# EAGLE schematic CYBERPHYS_DEMONSTRATOR_ARCHITECTURE_PHYSICAL_REV_D (EAGLE 9.6.2)
DOC_NAME: CYBERPHYS DEMONSTRATOR ARCHITECTURE - PHYSICAL; DOC_NUMBER: N/A; DOC_REVISION: D; INITIALS_CHECKED: TEAM; INITIALS_DRAWN: KJD

## Sheet 1 of 4
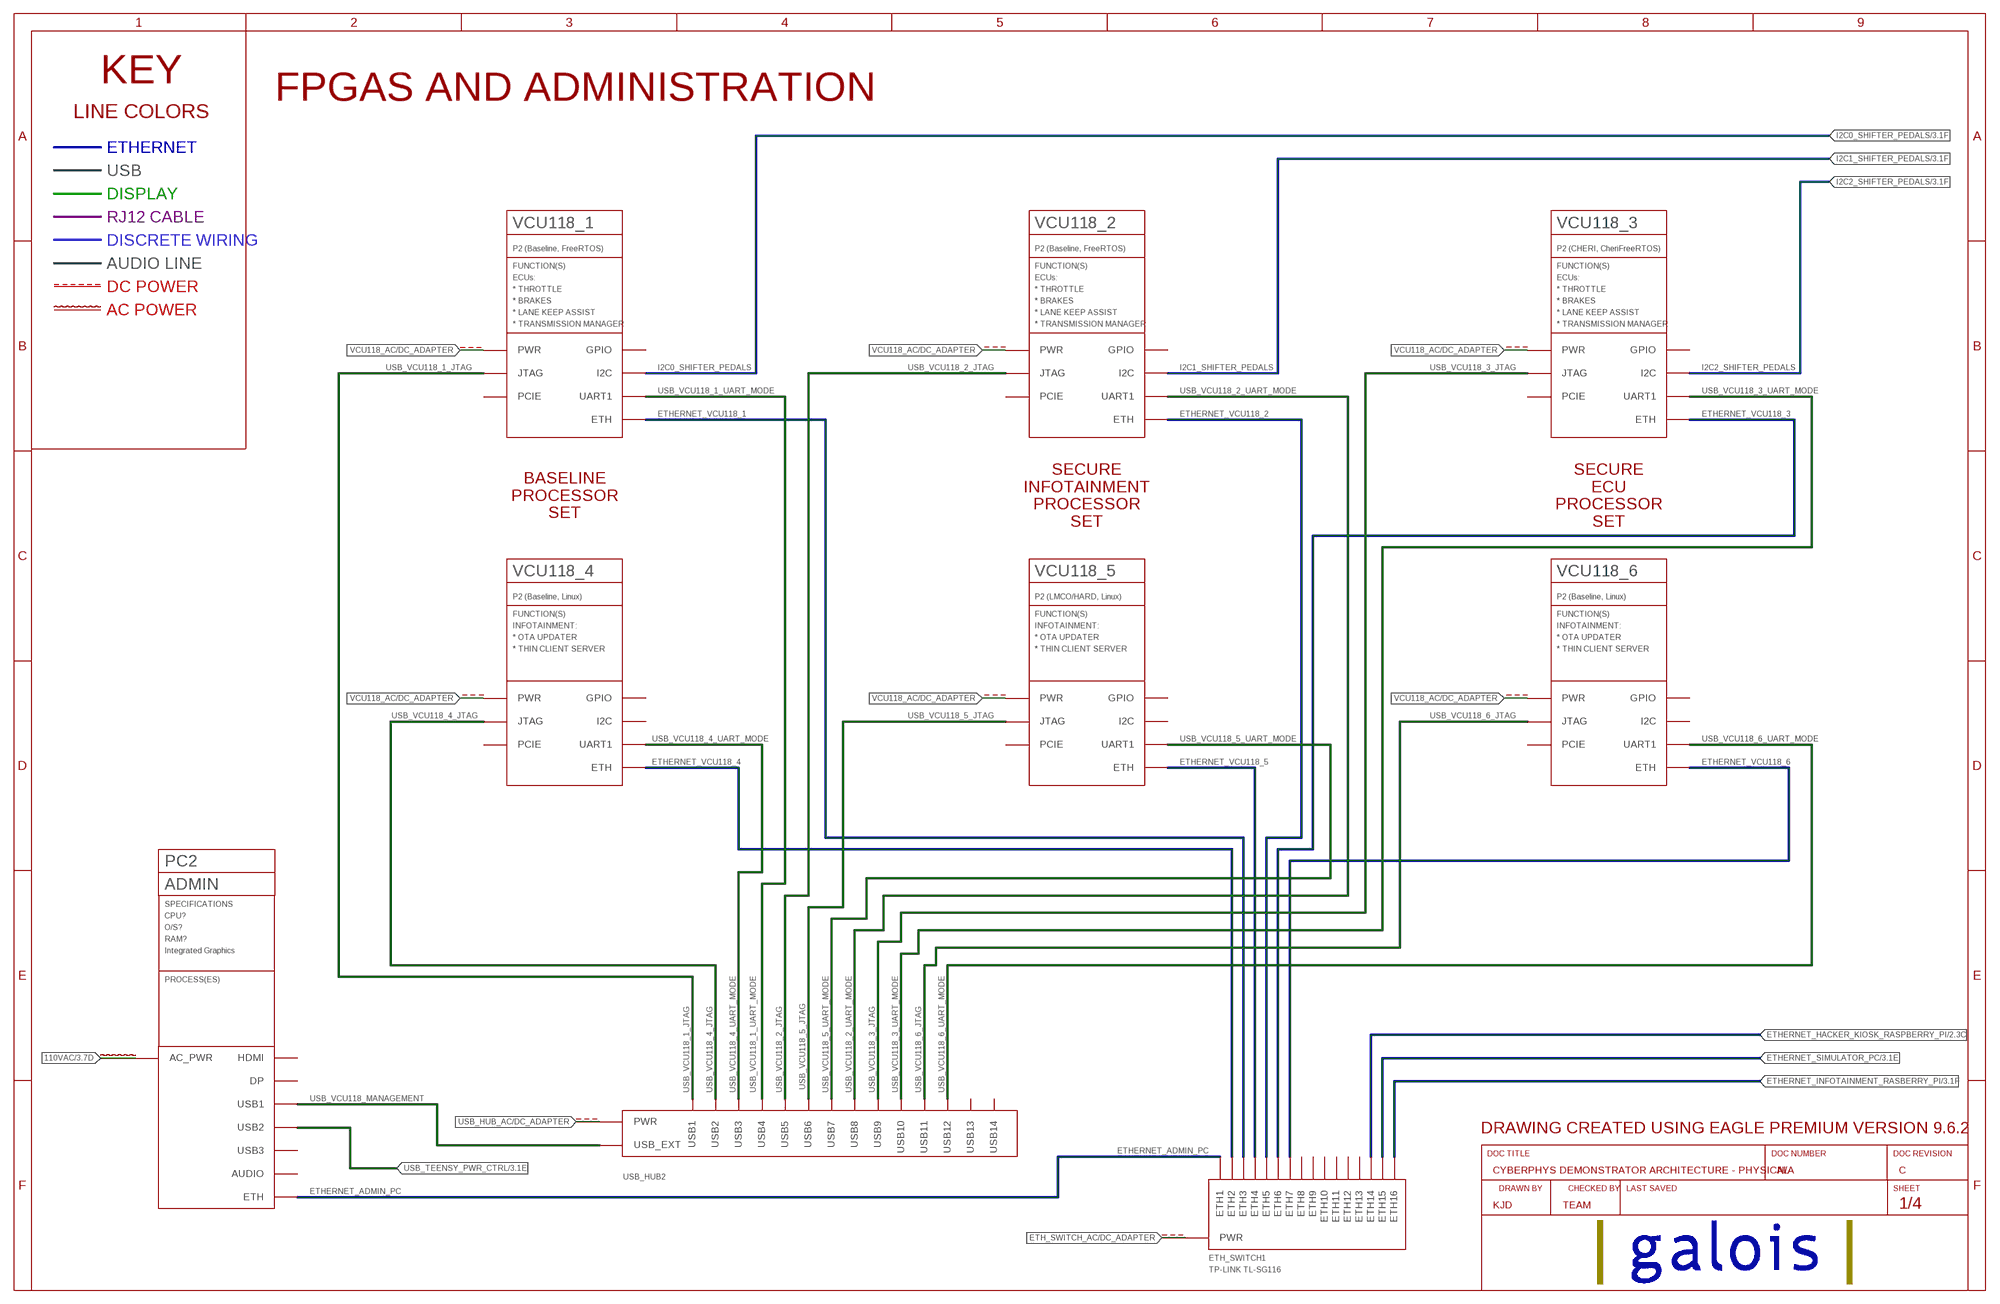
[diagram p0: schematic, sheet 1]

### Parts
ETH_SWITCH1  TP-LINK TL-SG116  SWITCH_16PORT  (no package)
PC2  ADMIN  PC  (no package)
USB_HUB2  USB_HUB_1X14  (no package)
VCU118_1  P2 (Baseline, FreeRTOS)  GFE//VCU118  (no package)
VCU118_2  P2 (Baseline, FreeRTOS)  GFE//VCU118  (no package)
VCU118_3  P2 (CHERI, CheriFreeRTOS)  GFE//VCU118  (no package)
VCU118_4  P2 (Baseline, Linux)  GFE//VCU118  (no package)
VCU118_5  P2 (LMCO/HARD, Linux)  GFE//VCU118  (no package)
VCU118_6  P2 (Baseline, Linux)  GFE//VCU118  (no package)

### Nets
110VAC: PC2.AC_PWR ; also sheet 3
ETH_SWITCH_AC/DC_ADAPTER: ETH_SWITCH1.PWR
ETHERNET_ADMIN_PC: ETH_SWITCH1.ETH1 PC2.ETH
ETHERNET_HACKER_KIOSK_RASPBERRY_PI: ETH_SWITCH1.ETH14 ; also sheet 2
ETHERNET_INFOTAINMENT_RASBERRY_PI: ETH_SWITCH1.ETH16 ; also sheet 3
ETHERNET_SIMULATOR_PC: ETH_SWITCH1.ETH15 ; also sheet 3
ETHERNET_VCU118_1: ETH_SWITCH1.ETH3 VCU118_1.ETH
ETHERNET_VCU118_2: ETH_SWITCH1.ETH5 VCU118_2.ETH
ETHERNET_VCU118_3: ETH_SWITCH1.ETH6 VCU118_3.ETH
ETHERNET_VCU118_4: ETH_SWITCH1.ETH2 VCU118_4.ETH
ETHERNET_VCU118_5: ETH_SWITCH1.ETH4 VCU118_5.ETH
ETHERNET_VCU118_6: ETH_SWITCH1.ETH7 VCU118_6.ETH
I2C0_SHIFTER_PEDALS: VCU118_1.I2C ; also sheet 3
I2C1_SHIFTER_PEDALS: VCU118_2.I2C ; also sheet 3
I2C2_SHIFTER_PEDALS: VCU118_3.I2C ; also sheet 3
USB_HUB_AC/DC_ADAPTER: USB_HUB2.PWR
USB_TEENSY_PWR_CTRL: PC2.USB2 ; also sheet 3
USB_VCU118_1_JTAG: USB_HUB2.USB1 VCU118_1.JTAG
USB_VCU118_1_UART_MODE: USB_HUB2.USB4 VCU118_1.UART1
USB_VCU118_2_JTAG: USB_HUB2.USB5 VCU118_2.JTAG
USB_VCU118_2_UART_MODE: USB_HUB2.USB8 VCU118_2.UART1
USB_VCU118_3_JTAG: USB_HUB2.USB9 VCU118_3.JTAG
USB_VCU118_3_UART_MODE: USB_HUB2.USB10 VCU118_3.UART1
USB_VCU118_4_JTAG: USB_HUB2.USB2 VCU118_4.JTAG
USB_VCU118_4_UART_MODE: USB_HUB2.USB3 VCU118_4.UART1
USB_VCU118_5_JTAG: USB_HUB2.USB6 VCU118_5.JTAG
USB_VCU118_5_UART_MODE: USB_HUB2.USB7 VCU118_5.UART1
USB_VCU118_6_JTAG: USB_HUB2.USB11 VCU118_6.JTAG
USB_VCU118_6_UART_MODE: USB_HUB2.USB12 VCU118_6.UART1
USB_VCU118_MANAGEMENT: PC2.USB1 USB_HUB2.USB_EXT
VCU118_AC/DC_ADAPTER: VCU118_1.PWR VCU118_2.PWR VCU118_3.PWR VCU118_4.PWR VCU118_5.PWR VCU118_6.PWR
Unconnected: ETH_SWITCH1.ETH8 ETH_SWITCH1.ETH9 ETH_SWITCH1.ETH10 ETH_SWITCH1.ETH11 ETH_SWITCH1.ETH12 ETH_SWITCH1.ETH13 PC2.AUDIO PC2.DP PC2.HDMI PC2.USB3 USB_HUB2.USB13 USB_HUB2.USB14 VCU118_1.GPIO VCU118_1.PCIE VCU118_2.GPIO VCU118_2.PCIE VCU118_3.GPIO VCU118_3.PCIE VCU118_4.GPIO VCU118_4.I2C VCU118_4.PCIE VCU118_5.GPIO VCU118_5.I2C VCU118_5.PCIE VCU118_6.GPIO VCU118_6.I2C VCU118_6.PCIE

### Notes on the sheet
- KEY | FPGAS AND ADMINISTRATION
- LINE COLORS
- ETHERNET
- USB
- DISPLAY
- RJ12 CABLE
- DISCRETE WIRING
- AUDIO LINE
- DC POWER
- AC POWER
- BASELINE
  PROCESSOR
  SET
- SECURE
  INFOTAINMENT
  PROCESSOR
  SET
- SECURE
  ECU
  PROCESSOR
  SET
- DRAWING CREATED USING EAGLE PREMIUM VERSION 9.6.2
- CYBERPHYS DEMONSTRATOR ARCHITECTURE - PHYSICAL | N/A | C
- KJD | TEAM

## Sheet 2 of 4
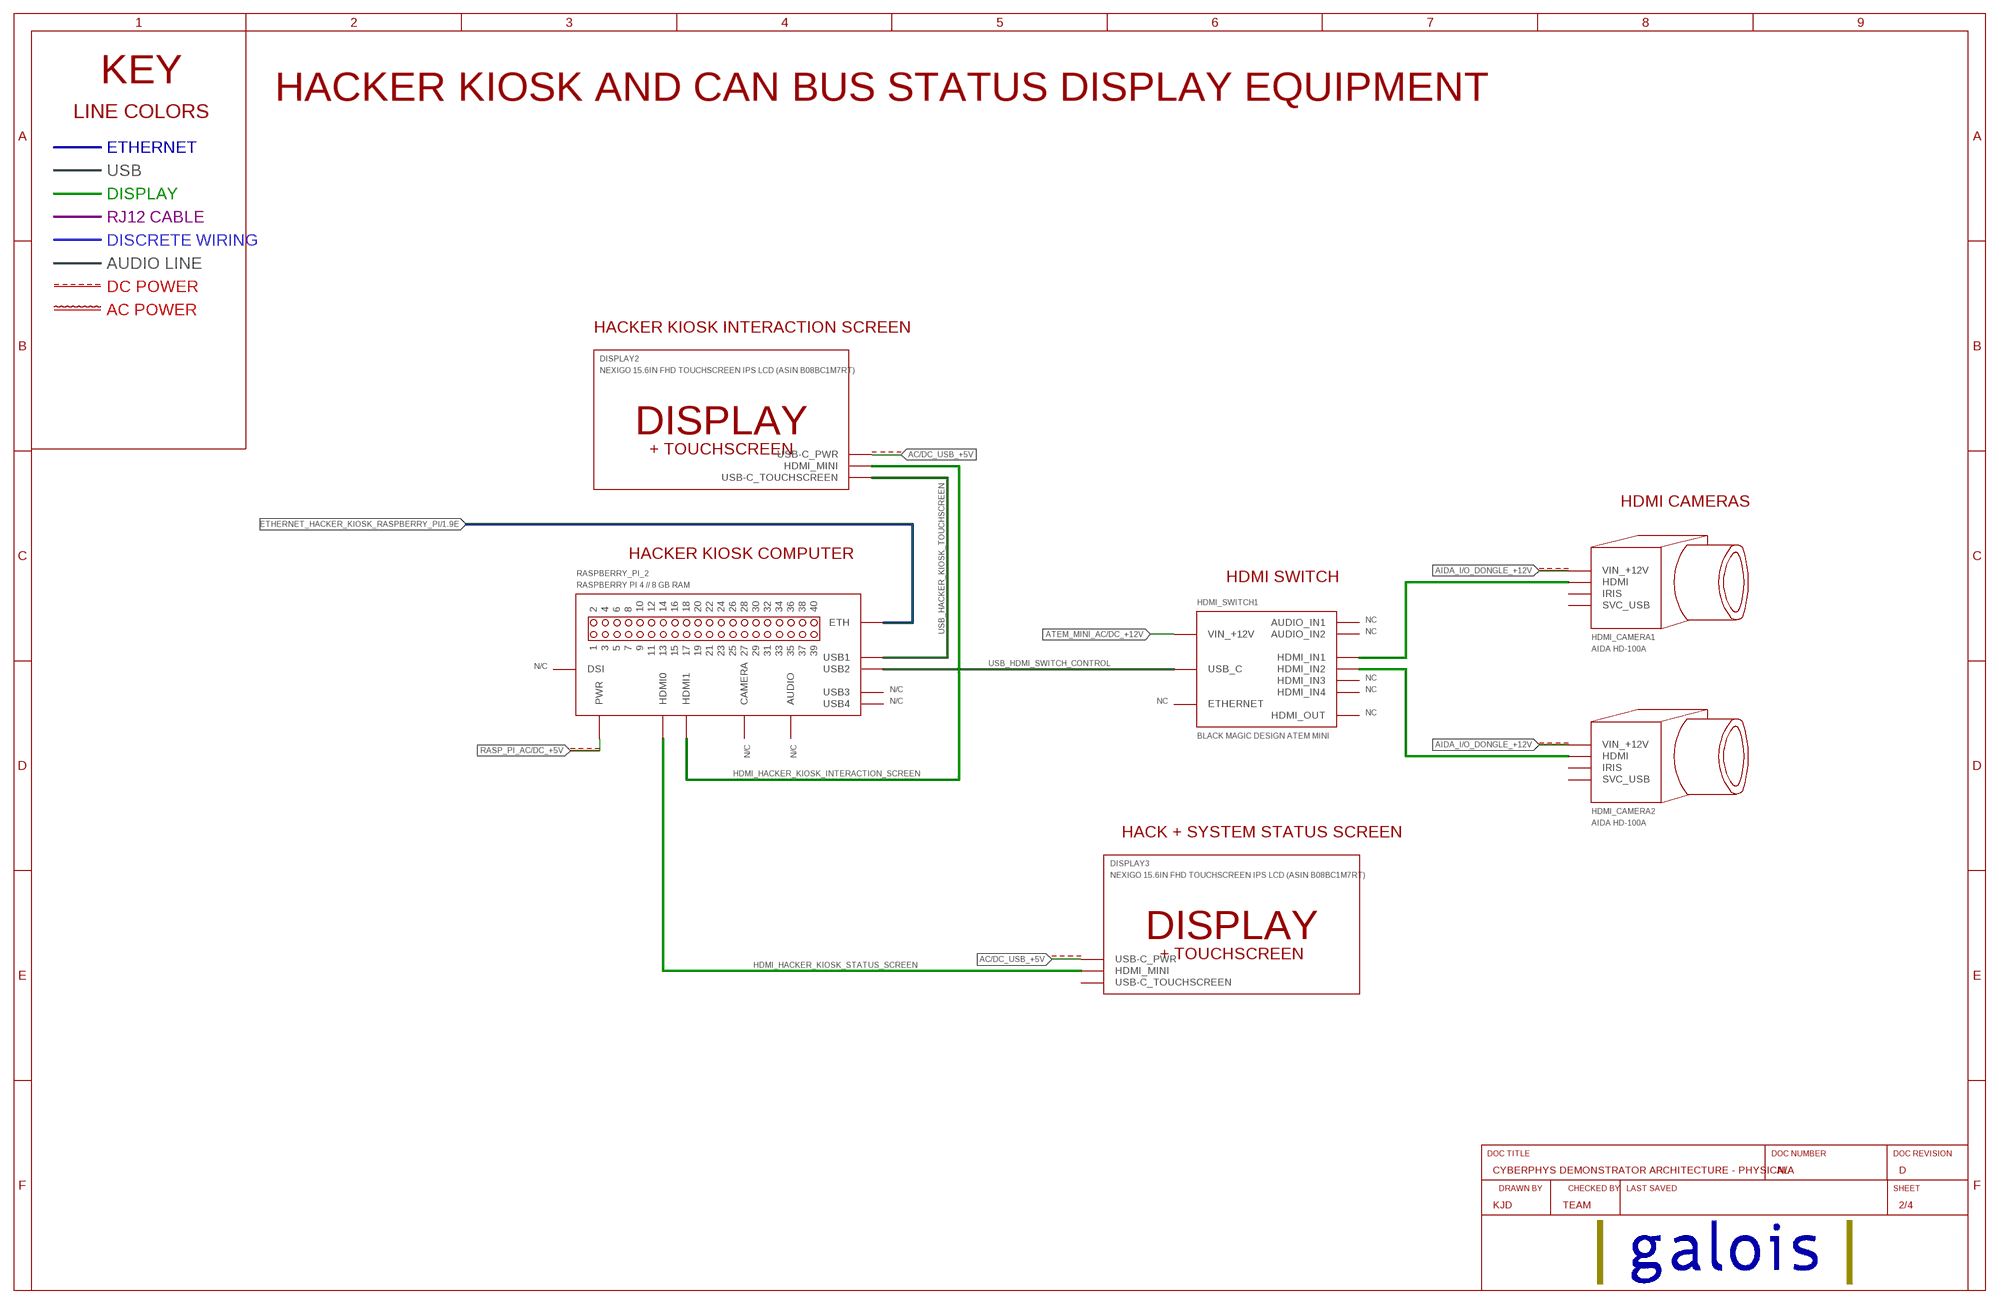
[diagram p1: schematic, sheet 2]

### Parts
DISPLAY2  NEXIGO 15.6IN FHD TOUCHSCREEN IPS LCD (ASIN B08BC1M7RT)  DISPLAY_SMALL_FORMAT  (no package)
DISPLAY3  NEXIGO 15.6IN FHD TOUCHSCREEN IPS LCD (ASIN B08BC1M7RT)  DISPLAY_SMALL_FORMAT  (no package)
HDMI_CAMERA1  AIDA HD-100A  HDMI_CAMERA  (no package)
HDMI_CAMERA2  AIDA HD-100A  HDMI_CAMERA  (no package)
HDMI_SWITCH1  BLACK MAGIC DESIGN ATEM MINI  HDMI_SWITCH  (no package)
RASPBERRY_PI_2  RASPBERRY PI 4 // 8 GB RAM  RASPBERRY_PI  (no package)

### Nets
AC/DC_USB_+5V: DISPLAY2.USB-C_PWR DISPLAY3.USB-C_PWR
AIDA_I/O_DONGLE_+12V: HDMI_CAMERA1.VIN_+12V HDMI_CAMERA2.VIN_+12V
ATEM_MINI_AC/DC_+12V: HDMI_SWITCH1.VIN_+12V
ETHERNET_HACKER_KIOSK_RASPBERRY_PI: RASPBERRY_PI_2.ETH ; also sheet 1
HDMI_HACKER_KIOSK_INTERACTION_SCREEN: DISPLAY2.HDMI_MINI RASPBERRY_PI_2.HDMI1
HDMI_HACKER_KIOSK_STATUS_SCREEN: DISPLAY3.HDMI_MINI RASPBERRY_PI_2.HDMI0
N$5: HDMI_CAMERA1.HDMI HDMI_SWITCH1.HDMI_IN1
N$6: HDMI_CAMERA2.HDMI HDMI_SWITCH1.HDMI_IN2
RASP_PI_AC/DC_+5V: RASPBERRY_PI_2.PWR
USB_HACKER_KIOSK_TOUCHSCREEN: DISPLAY2.USB-C_TOUCHSCREEN RASPBERRY_PI_2.USB1
USB_HDMI_SWITCH_CONTROL: HDMI_SWITCH1.USB_C RASPBERRY_PI_2.USB2
Unconnected: DISPLAY3.USB-C_TOUCHSCREEN HDMI_CAMERA1.IRIS HDMI_CAMERA1.SVC_USB HDMI_CAMERA2.IRIS HDMI_CAMERA2.SVC_USB HDMI_SWITCH1.AUDIO_IN1 HDMI_SWITCH1.AUDIO_IN2 HDMI_SWITCH1.ETHERNET HDMI_SWITCH1.HDMI_IN3 HDMI_SWITCH1.HDMI_IN4 HDMI_SWITCH1.HDMI_OUT RASPBERRY_PI_2.1 RASPBERRY_PI_2.2 RASPBERRY_PI_2.3 RASPBERRY_PI_2.4 RASPBERRY_PI_2.5 RASPBERRY_PI_2.6 RASPBERRY_PI_2.7 RASPBERRY_PI_2.8 RASPBERRY_PI_2.9 RASPBERRY_PI_2.10 RASPBERRY_PI_2.11 RASPBERRY_PI_2.12 RASPBERRY_PI_2.13 RASPBERRY_PI_2.14 RASPBERRY_PI_2.15 RASPBERRY_PI_2.16 RASPBERRY_PI_2.17 RASPBERRY_PI_2.18 RASPBERRY_PI_2.19 RASPBERRY_PI_2.20 RASPBERRY_PI_2.21 RASPBERRY_PI_2.22 RASPBERRY_PI_2.23 RASPBERRY_PI_2.24 RASPBERRY_PI_2.25 RASPBERRY_PI_2.26 RASPBERRY_PI_2.27 RASPBERRY_PI_2.28 RASPBERRY_PI_2.29 RASPBERRY_PI_2.30 RASPBERRY_PI_2.31 RASPBERRY_PI_2.32 RASPBERRY_PI_2.33 RASPBERRY_PI_2.34 RASPBERRY_PI_2.35 RASPBERRY_PI_2.36 RASPBERRY_PI_2.37 RASPBERRY_PI_2.38 RASPBERRY_PI_2.39 RASPBERRY_PI_2.40 RASPBERRY_PI_2.AUDIO RASPBERRY_PI_2.CAMERA RASPBERRY_PI_2.DSI RASPBERRY_PI_2.USB3 RASPBERRY_PI_2.USB4

### Notes on the sheet
- KEY | HACKER KIOSK AND CAN BUS STATUS DISPLAY EQUIPMENT
- LINE COLORS
- ETHERNET
- USB
- DISPLAY
- RJ12 CABLE
- DISCRETE WIRING
- AUDIO LINE
- DC POWER
- AC POWER
- HACKER KIOSK INTERACTION SCREEN
- HDMI CAMERAS
- HACKER KIOSK COMPUTER
- HDMI SWITCH
- NC
- NC
- N/C
- NC
- N/C | NC
- N/C | NC
- NC
- N/C | N/C
- HACK + SYSTEM STATUS SCREEN

## Sheet 3 of 4
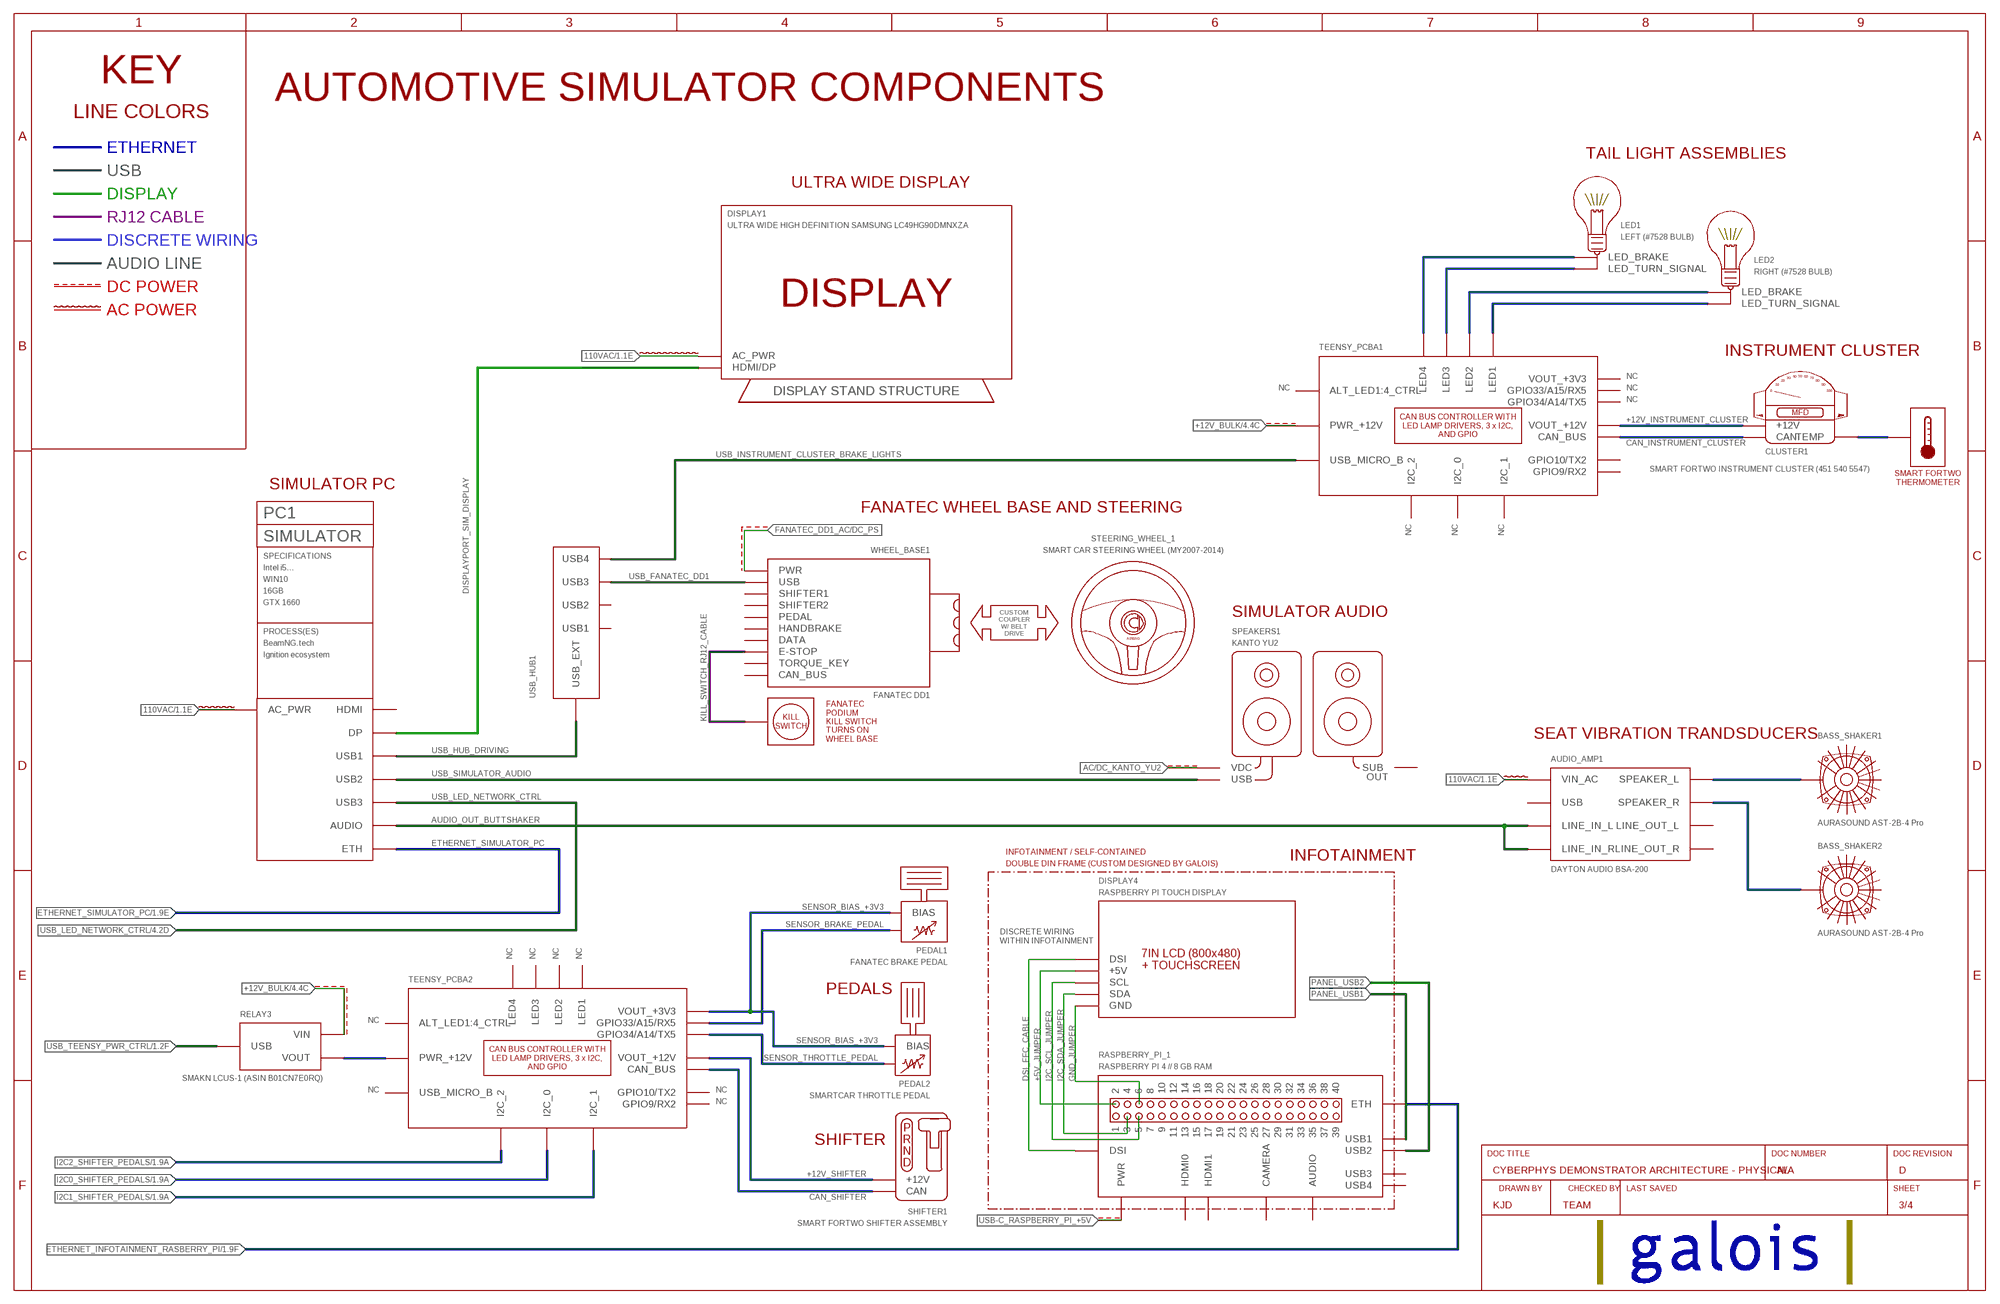
[diagram p2: schematic, sheet 3]

### Parts
AUDIO_AMP1  DAYTON AUDIO BSA-200  AUDIO_AMPLIFIER_BASS_SHAKER  (no package)
BASS_SHAKER1  AURASOUND AST-2B-4 Pro  TRANSDUCER_BASS_SHAKER  (no package)
BASS_SHAKER2  AURASOUND AST-2B-4 Pro  TRANSDUCER_BASS_SHAKER  (no package)
CLUSTER1  SMART FORTWO INSTRUMENT CLUSTER (451 540 5547)  SMARTCAR_INSTRUMENT_CLUSTER_CAN  (no package)
DISPLAY1  ULTRA WIDE HIGH DEFINITION SAMSUNG LC49HG90DMNXZA  DISPLAY_LARGE_FORMAT  (no package)
DISPLAY4  RASPBERRY PI TOUCH DISPLAY  RASPBERRY_PI_TOUCHSCREEN  (no package)
LED1  LEFT (#7528 BULB)  SMARTCAR_LIGHT_LED  (no package)
LED2  RIGHT (#7528 BULB)  SMARTCAR_LIGHT_LED  (no package)
PC1  SIMULATOR  PC  (no package)
PEDAL1  FANATEC BRAKE PEDAL  FANATEC_PEDAL_BRAKE_POTENTIOMETER  (no package)
PEDAL2  SMARTCAR THROTTLE PEDAL  SMARTCAR_PEDAL_THROTTLE_POTENTIOMETER  (no package)
RASPBERRY_PI_1  RASPBERRY PI 4 // 8 GB RAM  RASPBERRY_PI  (no package)
RELAY3  SMAKN LCUS-1 (ASIN B01CN7E0RQ)  USB_RELAY  (no package)
SHIFTER1  SMART FORTWO SHIFTER ASSEMBLY  SMARTCAR_SHIFTER_CAN  (no package)
SPEAKERS1  KANTO YU2  AUDIO_SPEAKERS_KANTO_YU2  (no package)
U$32  FANATEC_PODIUM_KILL_SWITCH  (no package)
U$33  SMARTCAR_THERMOMETER  (no package)
U$43  PCBA_CAN_BUS_CTRL_LED_DRIVER_SIMPLE  (no package)
U$44  PCBA_CAN_BUS_CTRL_LED_DRIVER_SIMPLE  (no package)
USB_HUB1  USB_HUB_1X4  (no package)
WHEEL_BASE1  FANATEC DD1  WHEEL_BASE  (no package)

### Nets
110VAC: AUDIO_AMP1.VIN_AC DISPLAY1.AC_PWR PC1.AC_PWR ; also sheet 1
+5V_JUMPER: DISPLAY4.+5V RASPBERRY_PI_1.2
+12V_BULK: RELAY3.VIN U$43.PWR_+12V ; also sheet 4
+12V_INSTRUMENT_CLUSTER: CLUSTER1.+12V U$43.VOUT_+12V
+12V_SHIFTER: SHIFTER1.+12V U$44.VOUT_+12V
AC/DC_KANTO_YU2: SPEAKERS1.VDC
AUDIO_OUT_BUTTSHAKER: AUDIO_AMP1.LINE_IN_L AUDIO_AMP1.LINE_IN_R PC1.AUDIO
CAN_INSTRUMENT_CLUSTER: CLUSTER1.CAN U$43.CAN_BUS
CAN_SHIFTER: SHIFTER1.CAN U$44.CAN_BUS
DISPLAYPORT_SIM_DISPLAY: DISPLAY1.HDMI/DP
DSI_FFC_CABLE: DISPLAY4.DSI RASPBERRY_PI_1.DSI
ETHERNET_INFOTAINMENT_RASBERRY_PI: RASPBERRY_PI_1.ETH ; also sheet 1
ETHERNET_SIMULATOR_PC: PC1.ETH ; also sheet 1
FANATEC_DD1_AC/DC_PS: WHEEL_BASE1.PWR
GND_JUMPER: DISPLAY4.GND RASPBERRY_PI_1.6
I2C0_SHIFTER_PEDALS: U$44.I2C_0 ; also sheet 1
I2C1_SHIFTER_PEDALS: U$44.I2C_1 ; also sheet 1
I2C2_SHIFTER_PEDALS: U$44.I2C_2 ; also sheet 1
I2C_SCL_JUMPER: DISPLAY4.SCL RASPBERRY_PI_1.5
I2C_SDA_JUMPER: DISPLAY4.SDA RASPBERRY_PI_1.3
KILL_SWITCH_RJ12_CABLE: U$32.P$1 WHEEL_BASE1.E-STOP
N$1: LED2.LED_TURN_SIGNAL U$43.LED1
N$2: LED2.LED_BRAKE U$43.LED2
N$3: LED1.LED_TURN_SIGNAL U$43.LED3
N$4: LED1.LED_BRAKE U$43.LED4
N$7: AUDIO_AMP1.SPEAKER_L BASS_SHAKER1.P$1
N$8: AUDIO_AMP1.SPEAKER_R BASS_SHAKER2.P$1
N$17: CLUSTER1.TEMP U$33.P$1
N$22: RELAY3.VOUT U$44.PWR_+12V
PANEL_USB1: RASPBERRY_PI_1.USB1
PANEL_USB2: RASPBERRY_PI_1.USB2
SENSOR_BIAS_+3V3: PEDAL1.BIAS PEDAL2.BIAS U$44.VOUT_+3V3
SENSOR_BRAKE_PEDAL: PEDAL1.RJ12 U$44.GPIO33/A15/RX5
SENSOR_THROTTLE_PEDAL: PEDAL2.POT U$44.GPIO34/A14/TX5
USB-C_RASPBERRY_PI_+5V: RASPBERRY_PI_1.PWR
USB_FANATEC_DD1: USB_HUB1.USB3 WHEEL_BASE1.USB
USB_HUB_DRIVING: PC1.USB1 USB_HUB1.USB_EXT
USB_INSTRUMENT_CLUSTER_BRAKE_LIGHTS: U$43.USB_MICRO_B USB_HUB1.USB4
USB_LED_NETWORK_CTRL: PC1.USB3 ; also sheet 4
USB_SIMULATOR_AUDIO: PC1.USB2 SPEAKERS1.USB
USB_TEENSY_PWR_CTRL: RELAY3.USB ; also sheet 1
Unconnected: AUDIO_AMP1.LINE_OUT_L AUDIO_AMP1.LINE_OUT_R AUDIO_AMP1.USB PC1.DP PC1.HDMI RASPBERRY_PI_1.1 RASPBERRY_PI_1.4 RASPBERRY_PI_1.7 RASPBERRY_PI_1.8 RASPBERRY_PI_1.9 RASPBERRY_PI_1.10 RASPBERRY_PI_1.11 RASPBERRY_PI_1.12 RASPBERRY_PI_1.13 RASPBERRY_PI_1.14 RASPBERRY_PI_1.15 RASPBERRY_PI_1.16 RASPBERRY_PI_1.17 RASPBERRY_PI_1.18 RASPBERRY_PI_1.19 RASPBERRY_PI_1.20 RASPBERRY_PI_1.21 RASPBERRY_PI_1.22 RASPBERRY_PI_1.23 RASPBERRY_PI_1.24 RASPBERRY_PI_1.25 RASPBERRY_PI_1.26 RASPBERRY_PI_1.27 RASPBERRY_PI_1.28 RASPBERRY_PI_1.29 RASPBERRY_PI_1.30 RASPBERRY_PI_1.31 RASPBERRY_PI_1.32 RASPBERRY_PI_1.33 RASPBERRY_PI_1.34 RASPBERRY_PI_1.35 RASPBERRY_PI_1.36 RASPBERRY_PI_1.37 RASPBERRY_PI_1.38 RASPBERRY_PI_1.39 RASPBERRY_PI_1.40 RASPBERRY_PI_1.AUDIO RASPBERRY_PI_1.CAMERA RASPBERRY_PI_1.HDMI0 RASPBERRY_PI_1.HDMI1 RASPBERRY_PI_1.USB3 RASPBERRY_PI_1.USB4 SPEAKERS1.SUB U$43.ALT_LED1:4_CTRL U$43.GPIO9/RX2 U$43.GPIO10/TX2 U$43.GPIO33/A15/RX5 U$43.GPIO34/A14/TX5 U$43.I2C_0 U$43.I2C_1 U$43.I2C_2 U$43.VOUT_+3V3 U$44.ALT_LED1:4_CTRL U$44.GPIO9/RX2 U$44.GPIO10/TX2 U$44.LED1 U$44.LED2 U$44.LED3 U$44.LED4 U$44.USB_MICRO_B USB_HUB1.USB1 USB_HUB1.USB2 WHEEL_BASE1.CAN_BUS WHEEL_BASE1.DATA WHEEL_BASE1.HANDBRAKE WHEEL_BASE1.PEDAL WHEEL_BASE1.SHIFTER1 WHEEL_BASE1.SHIFTER2 WHEEL_BASE1.TORQUE_KEY

### Notes on the sheet
- KEY | AUTOMOTIVE SIMULATOR COMPONENTS
- LINE COLORS
- ETHERNET
- TAIL LIGHT ASSEMBLIES
- USB
- ULTRA WIDE DISPLAY
- DISPLAY
- RJ12 CABLE
- DISCRETE WIRING
- AUDIO LINE
- DC POWER
- AC POWER
- TEENSY_PCBA1
- INSTRUMENT CLUSTER
- NC
- DISPLAY STAND STRUCTURE | NC | NC
- NC
- SIMULATOR PC
- FANATEC WHEEL BASE AND STEERING
- NC | NC | NC
- SIMULATOR AUDIO
- CUSTOM
  COUPLER
  W/ BELT
  DRIVE
- SEAT VIBRATION TRANDSDUCERS
- INFOTAINMENT / SELF-CONTAINED
- INFOTAINMENT
- DOUBLE DIN FRAME (CUSTOM DESIGNED BY GALOIS)
- DISCRETE WIRING
  WITHIN INFOTAINMENT
- NC | NC | NC | NC
- TEENSY_PCBA2
- PEDALS
- NC
- NC | NC
- NC
- SHIFTER

## Sheet 4 of 4
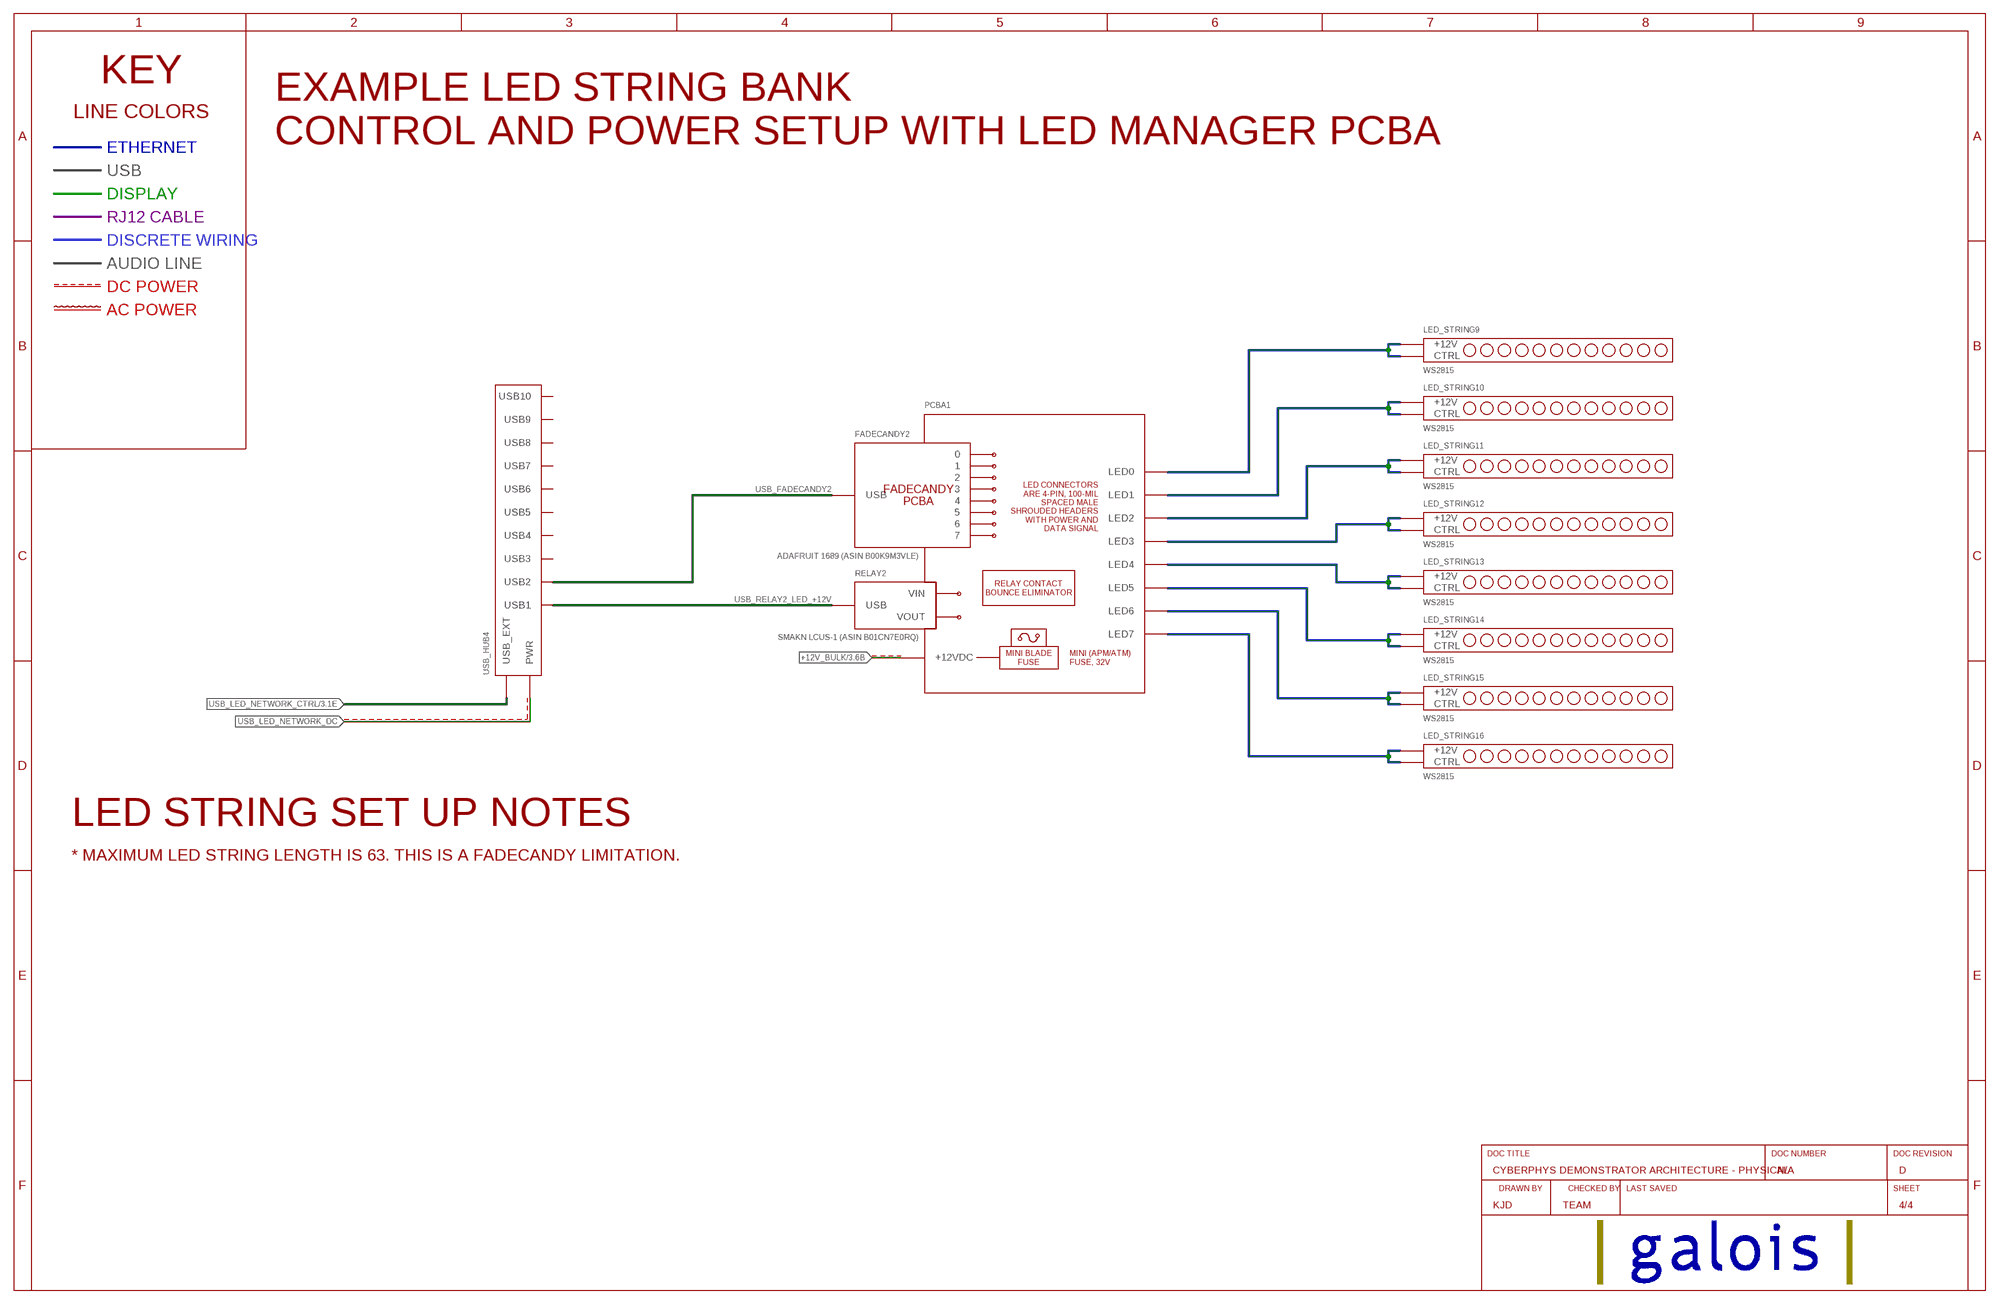
[diagram p3: schematic, sheet 4]

### Parts
FADECANDY2  ADAFRUIT 1689 (ASIN B00K9M3VLE)  FADECANDY_LED_DRIVER  (no package)
LED_STRING9  WS2815  WS2815_LED_STRING  (no package)
LED_STRING10  WS2815  WS2815_LED_STRING  (no package)
LED_STRING11  WS2815  WS2815_LED_STRING  (no package)
LED_STRING12  WS2815  WS2815_LED_STRING  (no package)
LED_STRING13  WS2815  WS2815_LED_STRING  (no package)
LED_STRING14  WS2815  WS2815_LED_STRING  (no package)
LED_STRING15  WS2815  WS2815_LED_STRING  (no package)
LED_STRING16  WS2815  WS2815_LED_STRING  (no package)
PCBA1  PCBA_LED_MANAGER  (no package)
RELAY2  SMAKN LCUS-1 (ASIN B01CN7E0RQ)  USB_RELAY  (no package)
USB_HUB4  USB_HUB_1X10  (no package)

### Nets
+12V_BULK: PCBA1.+12VDC ; also sheet 3
N$18: LED_STRING9.+12V LED_STRING9.CTRL PCBA1.LED0
N$19: LED_STRING10.+12V LED_STRING10.CTRL PCBA1.LED1
N$20: LED_STRING11.+12V LED_STRING11.CTRL PCBA1.LED2
N$21: LED_STRING12.+12V LED_STRING12.CTRL PCBA1.LED3
N$23: LED_STRING13.+12V LED_STRING13.CTRL PCBA1.LED4
N$24: LED_STRING14.+12V LED_STRING14.CTRL PCBA1.LED5
N$25: LED_STRING15.+12V LED_STRING15.CTRL PCBA1.LED6
N$27: LED_STRING16.+12V LED_STRING16.CTRL PCBA1.LED7
USB_FADECANDY2: FADECANDY2.USB USB_HUB4.USB2
USB_LED_NETWORK_CTRL: USB_HUB4.USB_EXT ; also sheet 3
USB_LED_NETWORK_DC: USB_HUB4.PWR
USB_RELAY2_LED_+12V: RELAY2.USB USB_HUB4.USB1
Unconnected: FADECANDY2.0 FADECANDY2.1 FADECANDY2.2 FADECANDY2.3 FADECANDY2.4 FADECANDY2.5 FADECANDY2.6 FADECANDY2.7 RELAY2.VIN RELAY2.VOUT USB_HUB4.USB3 USB_HUB4.USB4 USB_HUB4.USB5 USB_HUB4.USB6 USB_HUB4.USB7 USB_HUB4.USB8 USB_HUB4.USB9 USB_HUB4.USB10

### Notes on the sheet
- EXAMPLE LED STRING BANK
  CONTROL AND POWER SETUP WITH LED MANAGER PCBA
- KEY
- LINE COLORS
- ETHERNET
- USB
- DISPLAY
- RJ12 CABLE
- DISCRETE WIRING
- AUDIO LINE
- DC POWER
- AC POWER
- LED STRING SET UP NOTES
- * MAXIMUM LED STRING LENGTH IS 63. THIS IS A FADECANDY LIMITATION.

## Library data of the parts
AUDIO_AMP1 = USER_GALOIS_CYBERPHYS:AUDIO_AMPLIFIER_BASS_SHAKER
BASS_SHAKER1 BASS_SHAKER2 = USER_GALOIS_CYBERPHYS:TRANSDUCER_BASS_SHAKER
CLUSTER1 = USER_GALOIS_CYBERPHYS:SMARTCAR_INSTRUMENT_CLUSTER_CAN
DISPLAY1 = USER_GALOIS_CYBERPHYS:DISPLAY_LARGE_FORMAT
DISPLAY2 DISPLAY3 = USER_GALOIS_CYBERPHYS:DISPLAY_SMALL_FORMAT
DISPLAY4 = USER_GALOIS_CYBERPHYS:RASPBERRY_PI_TOUCHSCREEN
ETH_SWITCH1 = USER_GALOIS_CYBERPHYS:SWITCH_16PORT
FADECANDY2 = USER_GALOIS_CYBERPHYS:FADECANDY_LED_DRIVER
HDMI_CAMERA1 HDMI_CAMERA2 = USER_GALOIS_CYBERPHYS:HDMI_CAMERA
HDMI_SWITCH1 = USER_GALOIS_CYBERPHYS:HDMI_SWITCH
LED1 LED2 = USER_GALOIS_CYBERPHYS:SMARTCAR_LIGHT_LED
LED_STRING9-LED_STRING16 = USER_GALOIS_CYBERPHYS:WS2815_LED_STRING
PC1 = USER_GALOIS_CYBERPHYS:PC; GPU: GTX 1660; MEMORY: 16GB; OPERATING_SYSTEM: WIN10; PROCESS1: BeamNG.tech; PROCESS2: Ignition ecosystem; PROCESSOR: Intel i5...
PC2 = USER_GALOIS_CYBERPHYS:PC; GPU: Integrated Graphics; MEMORY: RAM?; OPERATING_SYSTEM: O/S?; PROCESS1: PICK-A-HACK; PROCESS2: MULTIPLEXING; PROCESSOR: CPU?
PCBA1 = USER_GALOIS_CYBERPHYS:PCBA_LED_MANAGER
PEDAL1 = USER_GALOIS_CYBERPHYS:FANATEC_PEDAL_BRAKE_POTENTIOMETER
PEDAL2 = USER_GALOIS_CYBERPHYS:SMARTCAR_PEDAL_THROTTLE_POTENTIOMETER
RASPBERRY_PI_1 RASPBERRY_PI_2 = USER_GALOIS_CYBERPHYS:RASPBERRY_PI
RELAY2 RELAY3 = USER_GALOIS_CYBERPHYS:USB_RELAY
SHIFTER1 = USER_GALOIS_CYBERPHYS:SMARTCAR_SHIFTER_CAN
SPEAKERS1 = USER_GALOIS_CYBERPHYS:AUDIO_SPEAKERS_KANTO_YU2
U$32 = USER_GALOIS_CYBERPHYS:FANATEC_PODIUM_KILL_SWITCH
U$33 = USER_GALOIS_CYBERPHYS:SMARTCAR_THERMOMETER
U$43 U$44 = USER_GALOIS_CYBERPHYS:PCBA_CAN_BUS_CTRL_LED_DRIVER_SIMPLE
USB_HUB1 = USER_GALOIS_CYBERPHYS:USB_HUB_1X4
USB_HUB2 = USER_GALOIS_CYBERPHYS:USB_HUB_1X14
USB_HUB4 = USER_GALOIS_CYBERPHYS:USB_HUB_1X10
VCU118_1-VCU118_3 = USER_GALOIS_CYBERPHYS:GFE//VCU118; FUNCTION1: ECUs:; FUNCTION2: * THROTTLE; FUNCTION3: * BRAKES; FUNCTION4: * LANE KEEP ASSIST; FUNCTION5: * TRANSMISSION MANAGER
VCU118_4-VCU118_6 = USER_GALOIS_CYBERPHYS:GFE//VCU118; FUNCTION1: INFOTAINMENT:; FUNCTION2: * OTA UPDATER; FUNCTION3: * THIN CLIENT SERVER
WHEEL_BASE1 = USER_GALOIS_CYBERPHYS:WHEEL_BASE